# Altium schematic sheet MCU.SchDoc
size A3; Organization: Altium Limited; Address1: L3, 12a Rodborough Rd; Address2: Frenchs Forest; Address3: NSW; Address4: Australia 2086
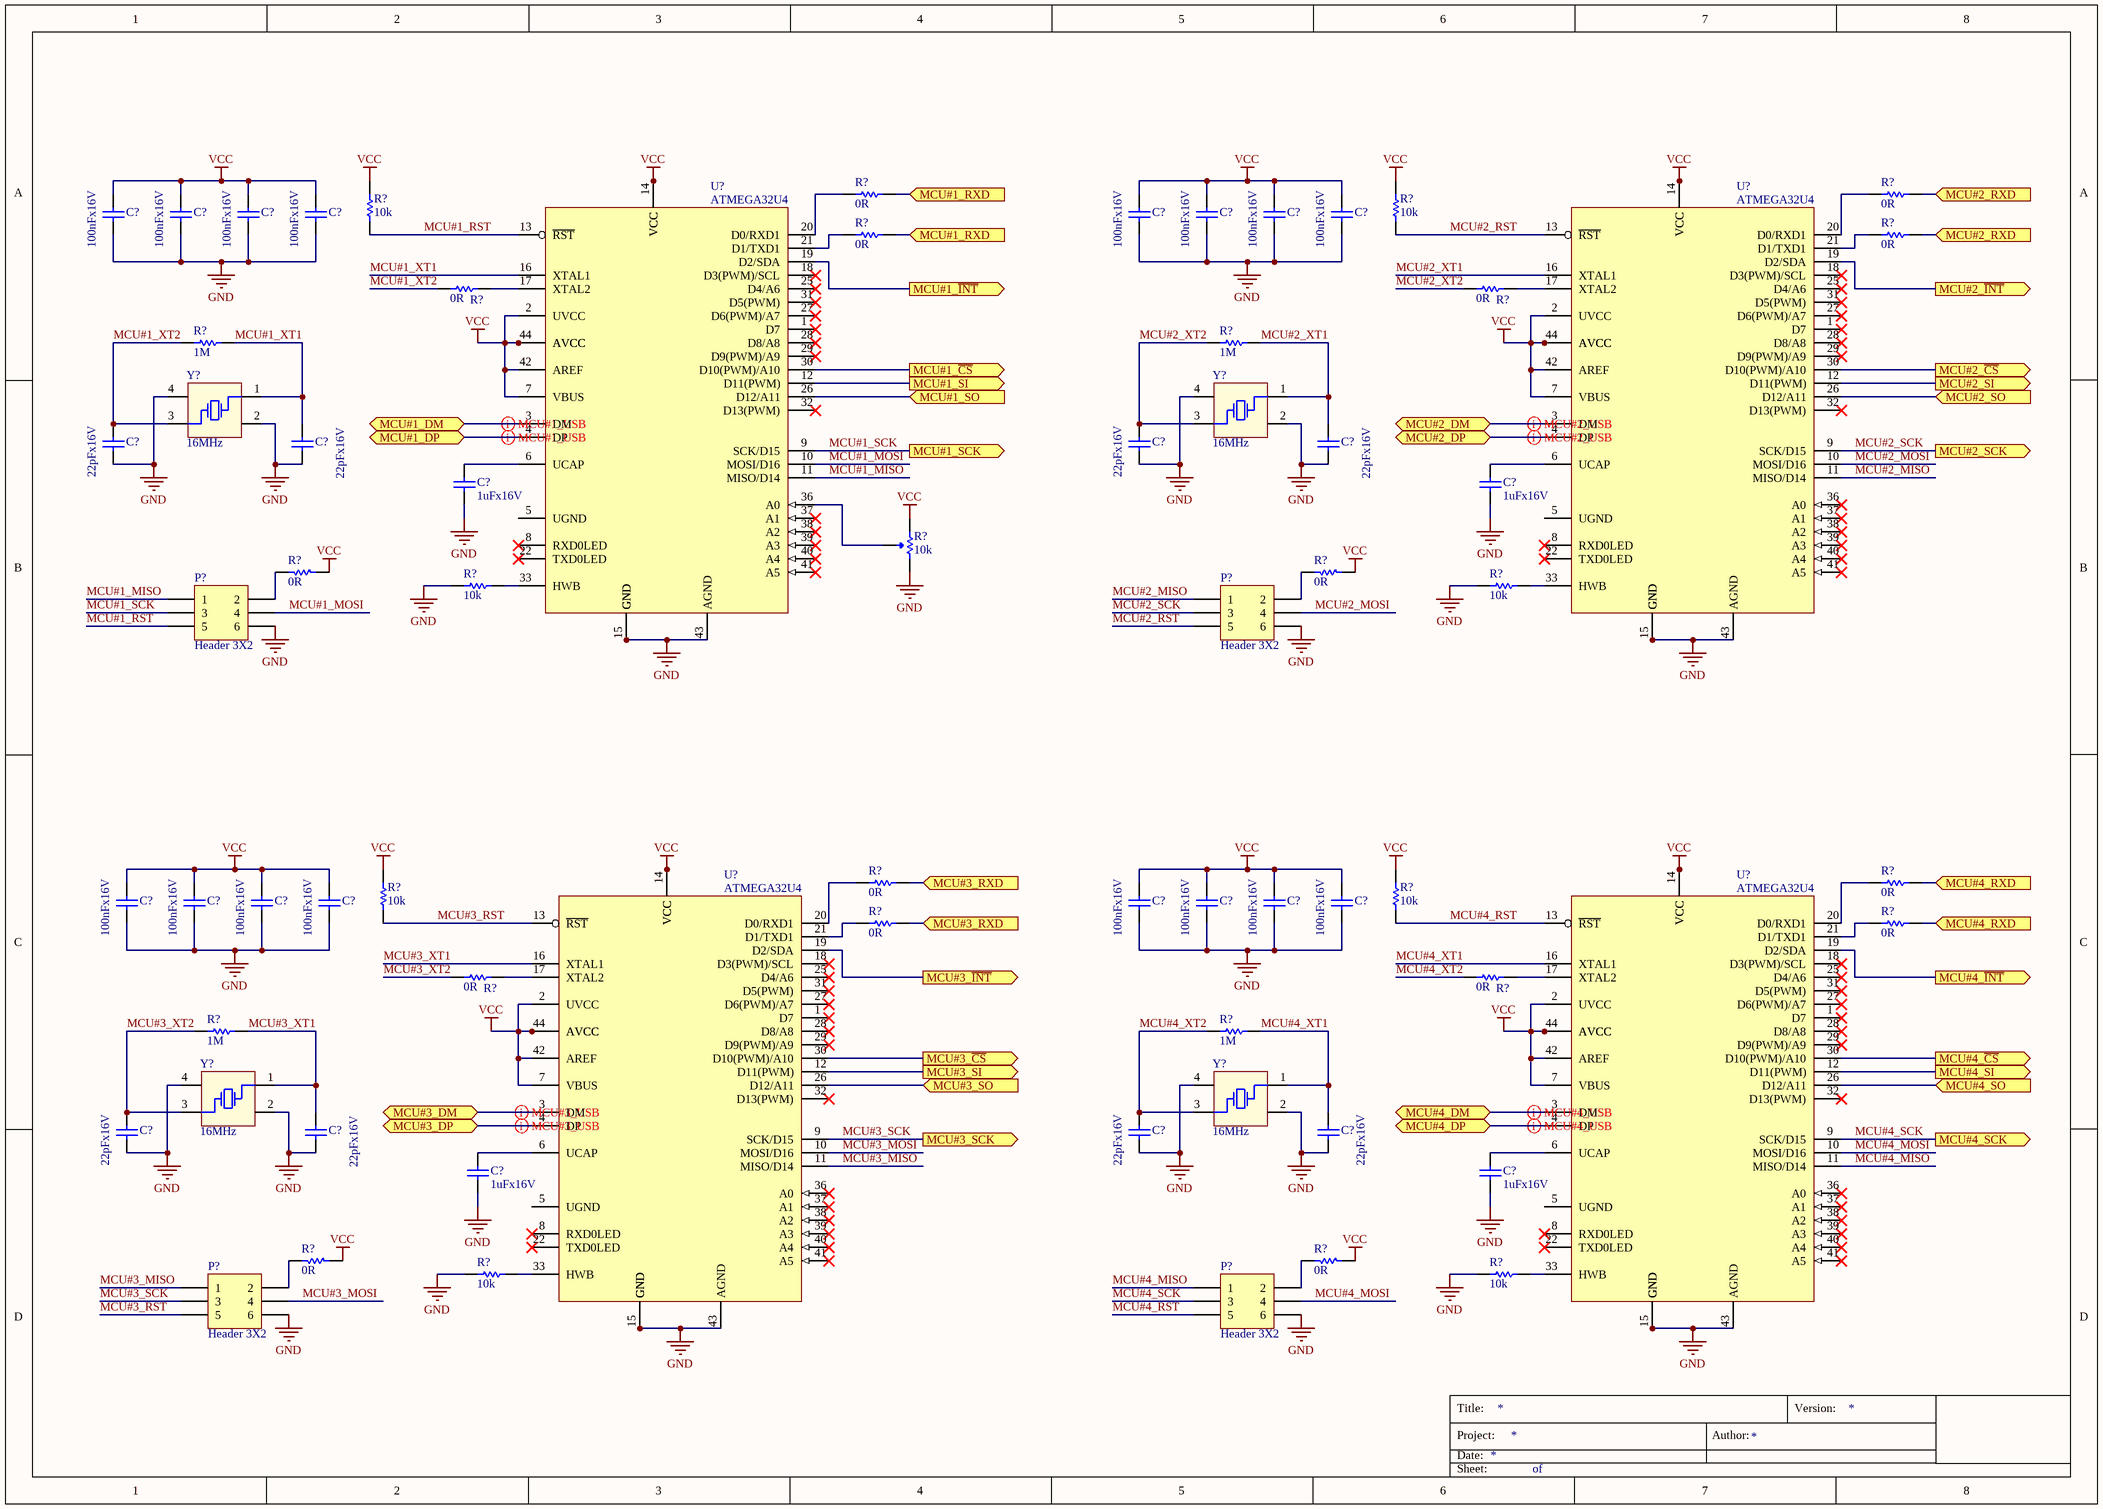
[diagram p0: MCU.SchDoc]

## Parts
(Parts that share a designator on the sheet are numbered #1, #2 ... from top to bottom, then left to right.)
C?#1  100nFx16V  [DISC-0603]
C?#2  100nFx16V  [DISC-0603]
C?#3  100nFx16V  [DISC-0603]
C?#4  100nFx16V  [DISC-0603]
C?#5  100nFx16V  [DISC-0603]
C?#6  100nFx16V  [DISC-0603]
C?#7  100nFx16V  [DISC-0603]
C?#8  100nFx16V  [DISC-0603]
C?#9  22pFx16V  [DISC-0805]
C?#10  22pFx16V  [DISC-0805]
C?#11  22pFx16V  [DISC-0805]
C?#12  22pFx16V  [DISC-0805]
C?#13  1uFx16V  [DISC-0603]
C?#14  1uFx16V  [DISC-0603]
C?#15  100nFx16V  [DISC-0603]
C?#16  100nFx16V  [DISC-0603]
C?#17  100nFx16V  [DISC-0603]
C?#18  100nFx16V  [DISC-0603]
C?#19  100nFx16V  [DISC-0603]
C?#20  100nFx16V  [DISC-0603]
C?#21  100nFx16V  [DISC-0603]
C?#22  100nFx16V  [DISC-0603]
C?#23  22pFx16V  [DISC-0805]
C?#24  22pFx16V  [DISC-0805]
C?#25  22pFx16V  [DISC-0805]
C?#26  22pFx16V  [DISC-0805]
C?#27  1uFx16V  [DISC-0603]
C?#28  1uFx16V  [DISC-0603]
P?#1  Header 3X2  [CON-HEADER-2X3-PTH]
P?#2  Header 3X2  [CON-HEADER-2X3-PTH]
P?#3  Header 3X2  [CON-HEADER-2X3-PTH]
P?#4  Header 3X2  [CON-HEADER-2X3-PTH]
R?#1  0R  [DISC-0603]
R?#2  0R  [DISC-0603]
R?#3  10k  [DISC-0805]
R?#4  0R  [DISC-0603]
R?#5  10k  [DISC-0805]
R?#6  0R  [DISC-0603]
R?#7  0R  [DISC-0603]
R?#8  0R  [DISC-0603]
R?#9  1M  [DISC-0805]
R?#10  1M  [DISC-0805]
R?#11  10k  [DISC-0805]
R?#12  10k  [DISC-TRIMPOT-TSR-3386]
R?#13  10k  [DISC-0805]
R?#14  0R  [DISC-0805]
R?#15  0R  [DISC-0805]
R?#16  0R  [DISC-0603]
R?#17  0R  [DISC-0603]
R?#18  10k  [DISC-0805]
R?#19  0R  [DISC-0603]
R?#20  10k  [DISC-0805]
R?#21  0R  [DISC-0603]
R?#22  0R  [DISC-0603]
R?#23  0R  [DISC-0603]
R?#24  1M  [DISC-0805]
R?#25  1M  [DISC-0805]
R?#26  10k  [DISC-0805]
R?#27  10k  [DISC-0805]
R?#28  0R  [DISC-0805]
R?#29  0R  [DISC-0805]
U?#1  ATMEGA32U4  [CI-QFP-44]
U?#2  ATMEGA32U4  [CI-QFP-44]
U?#3  ATMEGA32U4  [CI-QFP-44]
U?#4  ATMEGA32U4  [CI-QFP-44]
Y?#1  16MHz  [DISC-CRYSTAL-4P-3.2X2.5]
Y?#2  16MHz  [DISC-CRYSTAL-4P-3.2X2.5]
Y?#3  16MHz  [DISC-CRYSTAL-4P-3.2X2.5]
Y?#4  16MHz  [DISC-CRYSTAL-4P-3.2X2.5]

## Ports
MCU#1_DM (bidir), MCU#1_DP (bidir), MCU#1_RXD (in), MCU#1_SCK (out), MCU#1_SI (out), MCU#1_SO (in), MCU#1_~{CS} (out), MCU#1_~{INT} (out), MCU#2_DM (bidir), MCU#2_DP (bidir), MCU#2_RXD (in), MCU#2_SCK (out), MCU#2_SI (out), MCU#2_SO (in), MCU#2_~{CS} (out), MCU#2_~{INT} (out), MCU#3_DM (bidir), MCU#3_DP (bidir), MCU#3_RXD (in), MCU#3_SCK (out), MCU#3_SI (out), MCU#3_SO (in), MCU#3_~{CS} (out), MCU#3_~{INT} (out), MCU#4_DM (bidir), MCU#4_DP (bidir), MCU#4_RXD (in), MCU#4_SCK (out), MCU#4_SI (out), MCU#4_SO (in), MCU#4_~{CS} (out), MCU#4_~{INT} (out)

## Nets
GND: C?#1.2 C?#2.2 C?#3.2 C?#4.2 C?#5.2 C?#6.2 C?#7.2 C?#8.2 C?#9.1 C?#10.1 C?#11.1 C?#12.1 C?#13.1 C?#14.1 C?#15.2 C?#16.2 C?#17.2 C?#18.2 C?#19.2 C?#20.2 C?#21.2 C?#22.2 C?#23.1 C?#24.1 C?#25.1 C?#26.1 C?#27.1 C?#28.1 P?#1.6 P?#2.6 P?#3.6 P?#4.6 R?#11.1 R?#12.1 R?#13.1 R?#26.1 R?#27.1 U?#1.15(GND) U?#1.23(GND) U?#1.35(GND) U?#1.43(AGND) U?#2.15(GND) U?#2.23(GND) U?#2.35(GND) U?#2.43(AGND) U?#3.15(GND) U?#3.23(GND) U?#3.35(GND) U?#3.43(AGND) U?#4.15(GND) U?#4.23(GND) U?#4.35(GND) U?#4.43(AGND) Y?#1.2(GND) Y?#1.4(GND) Y?#2.2(GND) Y?#2.4(GND) Y?#3.2(GND) Y?#3.4(GND) Y?#4.2(GND) Y?#4.4(GND)
VCC: C?#1.1 C?#2.1 C?#3.1 C?#4.1 C?#5.1 C?#6.1 C?#7.1 C?#8.1 C?#15.1 C?#16.1 C?#17.1 C?#18.1 C?#19.1 C?#20.1 C?#21.1 C?#22.1 R?#3.2 R?#5.2 R?#12.3 R?#14.2 R?#15.2 R?#18.2 R?#20.2 R?#28.2 R?#29.2 U?#1.2(UVCC) U?#1.7(VBUS) U?#1.14(VCC) U?#1.24(AVCC) U?#1.34(VCC) U?#1.42(AREF) U?#1.44(AVCC) U?#2.2(UVCC) U?#2.7(VBUS) U?#2.14(VCC) U?#2.24(AVCC) U?#2.34(VCC) U?#2.42(AREF) U?#2.44(AVCC) U?#3.2(UVCC) U?#3.7(VBUS) U?#3.14(VCC) U?#3.24(AVCC) U?#3.34(VCC) U?#3.42(AREF) U?#3.44(AVCC) U?#4.2(UVCC) U?#4.7(VBUS) U?#4.14(VCC) U?#4.24(AVCC) U?#4.34(VCC) U?#4.42(AREF) U?#4.44(AVCC)
MCU#1_~{CS}: U?#1.30(D10(PWM)/A10) ; port MCU#1_~{CS}
MCU#1_DM: U?#1.3(DM) ; port MCU#1_DM
MCU#1_DP: U?#1.4(DP) ; port MCU#1_DP
MCU#1_~{INT}: U?#1.19(D2/SDA) ; port MCU#1_~{INT}
MCU#1_MISO: P?#1.1 U?#1.11(MISO/D14)
MCU#1_MOSI: P?#1.4 U?#1.10(MOSI/D16)
MCU#1_RST: P?#1.5 R?#3.1 U?#1.13(~{RST})
MCU#1_RXD: R?#1.2 R?#4.2 ; port MCU#1_RXD
MCU#1_SCK: P?#1.3 U?#1.9(SCK/D15) ; port MCU#1_SCK
MCU#1_SI: U?#1.12(D11(PWM)) ; port MCU#1_SI
MCU#1_SO: U?#1.26(D12/A11) ; port MCU#1_SO
MCU#1_XT1: C?#10.2 R?#9.2 U?#1.16(XTAL1) Y?#1.1(OSC1)
MCU#1_XT2: C?#9.2 R?#7.1 R?#9.1 Y?#1.3(OSC2)
MCU#2_~{CS}: U?#2.30(D10(PWM)/A10) ; port MCU#2_~{CS}
MCU#2_DM: U?#2.3(DM) ; port MCU#2_DM
MCU#2_DP: U?#2.4(DP) ; port MCU#2_DP
MCU#2_~{INT}: U?#2.19(D2/SDA) ; port MCU#2_~{INT}
MCU#2_MISO: P?#2.1 U?#2.11(MISO/D14)
MCU#2_MOSI: P?#2.4 U?#2.10(MOSI/D16)
MCU#2_RST: P?#2.5 R?#5.1 U?#2.13(~{RST})
MCU#2_RXD: R?#2.2 R?#6.2 ; port MCU#2_RXD
MCU#2_SCK: P?#2.3 U?#2.9(SCK/D15) ; port MCU#2_SCK
MCU#2_SI: U?#2.12(D11(PWM)) ; port MCU#2_SI
MCU#2_SO: U?#2.26(D12/A11) ; port MCU#2_SO
MCU#2_XT1: C?#12.2 R?#10.2 U?#2.16(XTAL1) Y?#2.1(OSC1)
MCU#2_XT2: C?#11.2 R?#8.1 R?#10.1 Y?#2.3(OSC2)
MCU#3_~{CS}: U?#3.30(D10(PWM)/A10) ; port MCU#3_~{CS}
MCU#3_DM: U?#3.3(DM) ; port MCU#3_DM
MCU#3_DP: U?#3.4(DP) ; port MCU#3_DP
MCU#3_~{INT}: U?#3.19(D2/SDA) ; port MCU#3_~{INT}
MCU#3_MISO: P?#3.1 U?#3.11(MISO/D14)
MCU#3_MOSI: P?#3.4 U?#3.10(MOSI/D16)
MCU#3_RST: P?#3.5 R?#18.1 U?#3.13(~{RST})
MCU#3_RXD: R?#16.2 R?#19.2 ; port MCU#3_RXD
MCU#3_SCK: P?#3.3 U?#3.9(SCK/D15) ; port MCU#3_SCK
MCU#3_SI: U?#3.12(D11(PWM)) ; port MCU#3_SI
MCU#3_SO: U?#3.26(D12/A11) ; port MCU#3_SO
MCU#3_XT1: C?#24.2 R?#24.2 U?#3.16(XTAL1) Y?#3.1(OSC1)
MCU#3_XT2: C?#23.2 R?#22.1 R?#24.1 Y?#3.3(OSC2)
MCU#4_~{CS}: U?#4.30(D10(PWM)/A10) ; port MCU#4_~{CS}
MCU#4_DM: U?#4.3(DM) ; port MCU#4_DM
MCU#4_DP: U?#4.4(DP) ; port MCU#4_DP
MCU#4_~{INT}: U?#4.19(D2/SDA) ; port MCU#4_~{INT}
MCU#4_MISO: P?#4.1 U?#4.11(MISO/D14)
MCU#4_MOSI: P?#4.4 U?#4.10(MOSI/D16)
MCU#4_RST: P?#4.5 R?#20.1 U?#4.13(~{RST})
MCU#4_RXD: R?#17.2 R?#21.2 ; port MCU#4_RXD
MCU#4_SCK: P?#4.3 U?#4.9(SCK/D15) ; port MCU#4_SCK
MCU#4_SI: U?#4.12(D11(PWM)) ; port MCU#4_SI
MCU#4_SO: U?#4.26(D12/A11) ; port MCU#4_SO
MCU#4_XT1: C?#26.2 R?#25.2 U?#4.16(XTAL1) Y?#4.1(OSC1)
MCU#4_XT2: C?#25.2 R?#23.1 R?#25.1 Y?#4.3(OSC2)
NetC?#13_2: C?#13.2 U?#1.6(UCAP)
NetC?#14_2: C?#14.2 U?#2.6(UCAP)
NetC?#27_2: C?#27.2 U?#3.6(UCAP)
NetC?#28_2: C?#28.2 U?#4.6(UCAP)
NetP?#1_2: P?#1.2 R?#14.1
NetP?#2_2: P?#2.2 R?#15.1
NetP?#3_2: P?#3.2 R?#28.1
NetP?#4_2: P?#4.2 R?#29.1
NetR?#1_1: R?#1.1 U?#1.20(D0/RXD1)
NetR?#2_1: R?#2.1 U?#2.20(D0/RXD1)
NetR?#4_1: R?#4.1 U?#1.21(D1/TXD1)
NetR?#6_1: R?#6.1 U?#2.21(D1/TXD1)
NetR?#7_2: R?#7.2 U?#1.17(XTAL2)
NetR?#8_2: R?#8.2 U?#2.17(XTAL2)
NetR?#11_2: R?#11.2 U?#1.33(HWB)
NetR?#12_2: R?#12.2 U?#1.36(A0)
NetR?#13_2: R?#13.2 U?#2.33(HWB)
NetR?#16_1: R?#16.1 U?#3.20(D0/RXD1)
NetR?#17_1: R?#17.1 U?#4.20(D0/RXD1)
NetR?#19_1: R?#19.1 U?#3.21(D1/TXD1)
NetR?#21_1: R?#21.1 U?#4.21(D1/TXD1)
NetR?#22_2: R?#22.2 U?#3.17(XTAL2)
NetR?#23_2: R?#23.2 U?#4.17(XTAL2)
NetR?#26_2: R?#26.2 U?#3.33(HWB)
NetR?#27_2: R?#27.2 U?#4.33(HWB)

Not connected (* = marked no-connect by the designer): U?#1 1(D7)* 5(UGND) 8(RXD0LED)* 18(D3(PWM)/SCL)* 22(TXD0LED)* 25(D4/A6)* 27(D6(PWM)/A7)* 28(D8/A8)* 29(D9(PWM)/A9)* 31(D5(PWM))* 32(D13(PWM))* 37(A1)* 38(A2)* 39(A3)* 40(A4)* 41(A5)*; U?#2 1(D7)* 5(UGND) 8(RXD0LED)* 18(D3(PWM)/SCL)* 22(TXD0LED)* 25(D4/A6)* 27(D6(PWM)/A7)* 28(D8/A8)* 29(D9(PWM)/A9)* 31(D5(PWM))* 32(D13(PWM))* 36(A0)* 37(A1)* 38(A2)* 39(A3)* 40(A4)* 41(A5)*; U?#3 1(D7)* 5(UGND) 8(RXD0LED)* 18(D3(PWM)/SCL)* 22(TXD0LED)* 25(D4/A6)* 27(D6(PWM)/A7)* 28(D8/A8)* 29(D9(PWM)/A9)* 31(D5(PWM))* 32(D13(PWM))* 36(A0)* 37(A1)* 38(A2)* 39(A3)* 40(A4)* 41(A5)*; U?#4 1(D7)* 5(UGND) 8(RXD0LED)* 18(D3(PWM)/SCL)* 22(TXD0LED)* 25(D4/A6)* 27(D6(PWM)/A7)* 28(D8/A8)* 29(D9(PWM)/A9)* 31(D5(PWM))* 32(D13(PWM))* 36(A0)* 37(A1)* 38(A2)* 39(A3)* 40(A4)* 41(A5)*

## Layout directives
differential pair: MCU#1_DM, MCU#1_DP, MCU#2_DM, MCU#2_DP, MCU#3_DM, MCU#3_DP, MCU#4_DM, MCU#4_DP

## Notes on the sheet
- Title:
- Project:
- Date:
- Author:
- Version:
- Sheet:
- of

## Library data of the parts
C?#1-C?#28 = Cap: Capacitor
P?#1-P?#4 = Header 3X2: Header, 3-Pin, Dual row; LatestRevisionDate: 17-Jul-2002; LatestRevisionNote: Re-released for DXP Platform.; Publisher: Altium Limited
R?#1-R?#11 R?#13-R?#29 = Res: Resistor
R?#12 = VariableResistor: Resistor
U?#1-U?#4 = ATMEGA32U4-AU: 8-bit Microcontroller with 16/32K bytes of ISP Flash and  USB Controller
Y?#1-Y?#4 = XTAL-4-PIN